# Altium schematic sheet Sheet1.SchDoc
size A4
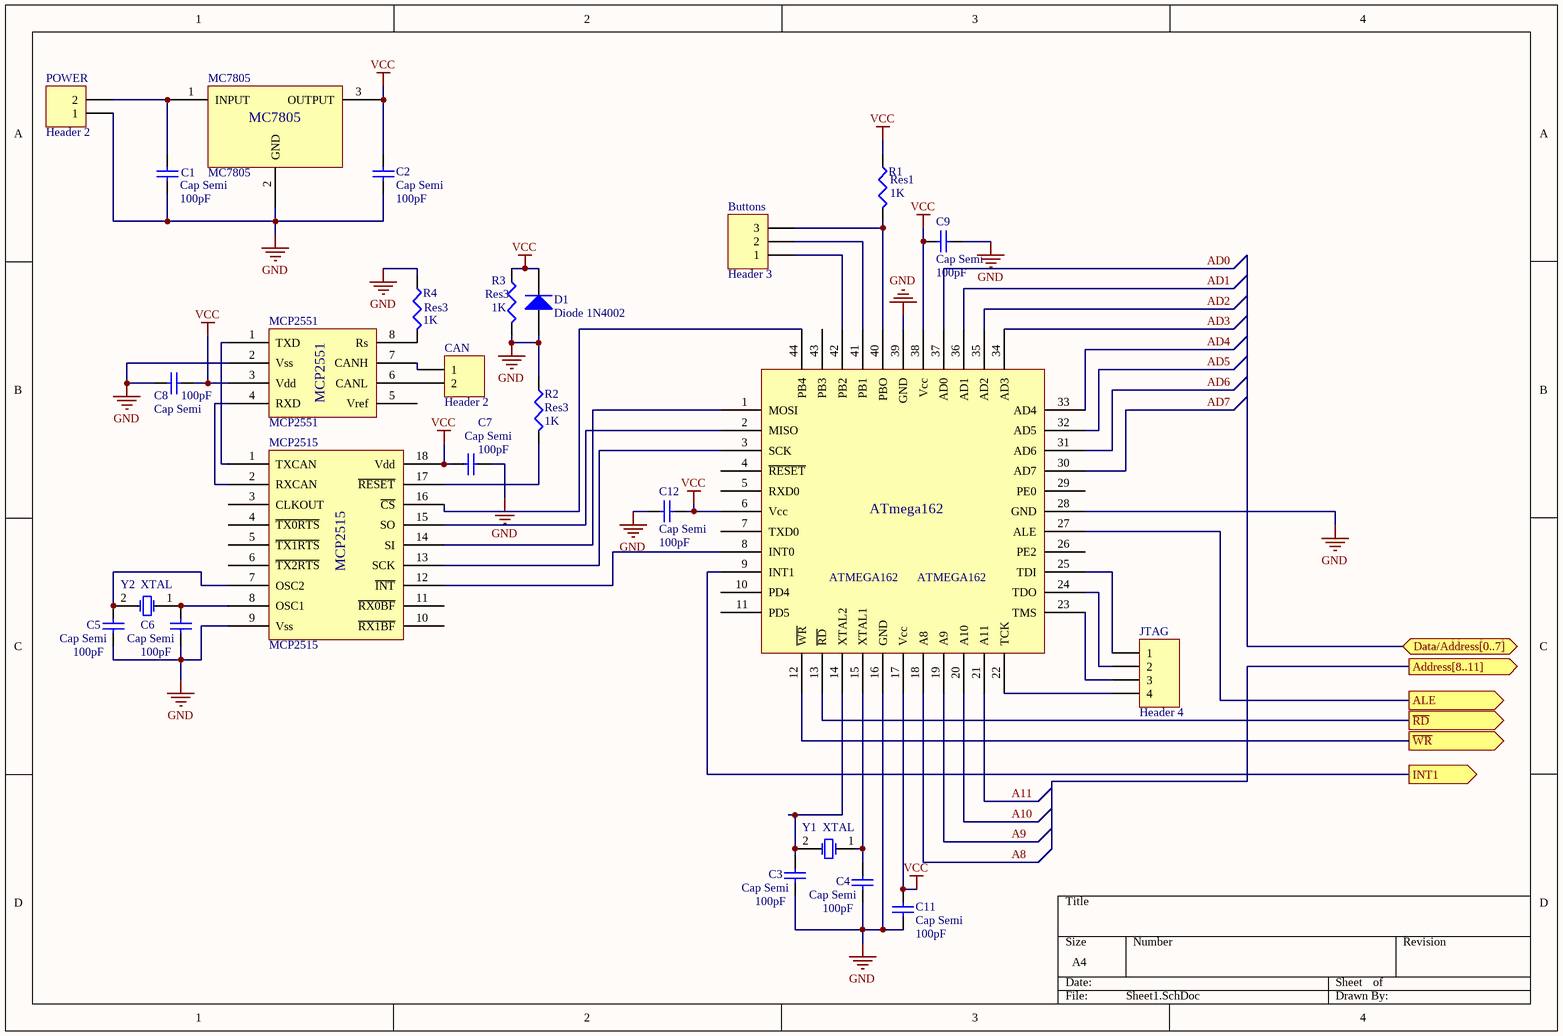
[diagram p0: Sheet1.SchDoc]

## Parts
ATMEGA162  ATMEGA162  [ATmega162 TQFP 44-pin]
Buttons  Header 3  [HDR1X3]
C1  Cap Semi  value 100pF  [C1210]
C2  Cap Semi  value 100pF  [C1210]
C3  Cap Semi  value 100pF  [C1210]
C4  Cap Semi  value 100pF  [C1210]
C5  Cap Semi  value 100pF  [C1210]
C6  Cap Semi  value 100pF  [C1210]
C7  Cap Semi  value 100pF  [C1210]
C8  Cap Semi  value 100pF  [C1210]
C9  Cap Semi  value 100pF  [C1210]
C11  Cap Semi  value 100pF  [C1210]
C12  Cap Semi  value 100pF  [C1210]
CAN  Header 2  [HDR1X2]
D1  Diode 1N4002  [DO-41]
JTAG  Header 4  [HDR1X4]
MC7805  MC7805  [MC7805 DPAK 3-PIN]
MCP2515  MCP2515  [MCP2515 SOIC 18-PIN]
MCP2551  MCP2551  [MACP2551 SOIC 8-PIN]
POWER  Header 2  [HDR1X2]
R1  Res1  value 1K  [14-1210]
R2  Res3  value 1K  [J1-0603]
R3  Res3  value 1K  [J1-0603]
R4  Res3  value 1K  [J1-0603]
Y1  XTAL  [R38]
Y2  XTAL  [R38]

## Ports
Address[8..11] (out), ALE (out), Data/Address[0..7] (bidir), INT1 (out), ~{RD} (out), ~{WR} (out)

## Nets
GND: ATMEGA162.16(GND) ATMEGA162.28(GND) ATMEGA162.39(GND) C1.1 C2.1 C3.2 C4.1 C5.2 C6.2 C7.1 C8.2 C9.2 C11.2 C12.2 D1.1(A) MC7805.2(GND) MCP2515.9(Vss) MCP2551.2(Vss) POWER.1 R2.1 R3.2 R4.1
VCC: ATMEGA162.6(Vcc) ATMEGA162.17(Vcc) ATMEGA162.38(Vcc) C2.2 C7.2 C8.1 C9.1 C11.1 C12.1 D1.2(K) MC7805.3(OUTPUT) MCP2515.18(Vdd) MCP2551.3(Vdd) R1.1 R3.1
A8: ATMEGA162.18(A8)
A9: ATMEGA162.19(A9)
A10: ATMEGA162.20(A10)
A11: ATMEGA162.21(A11)
AD0: ATMEGA162.37(AD0)
AD1: ATMEGA162.36(AD1)
AD2: ATMEGA162.35(AD2)
AD3: ATMEGA162.34(AD3)
AD4: ATMEGA162.33(AD4)
AD5: ATMEGA162.32(AD5)
AD6: ATMEGA162.31(AD6)
AD7: ATMEGA162.30(AD7)
ALE: ATMEGA162.27(ALE) ; port ALE
INT1: ATMEGA162.9(INT1) ; port INT1
~{RD}: ATMEGA162.13(~{RD}) ; port ~{RD}
~{WR}: ATMEGA162.12(~{WR}) ; port ~{WR}
NetATMEGA162_1: ATMEGA162.1(MOSI) MCP2515.14(SI)
NetATMEGA162_2: ATMEGA162.2(MISO) MCP2515.15(SO)
NetATMEGA162_3: ATMEGA162.3(SCK) MCP2515.13(SCK)
NetATMEGA162_8: ATMEGA162.8(INT0) MCP2515.12(~{INT})
NetATMEGA162_14: ATMEGA162.14(XTAL2) C3.1 Y1.2(OSC2)
NetATMEGA162_15: ATMEGA162.15(XTAL1) C4.2 Y1.1(OSC1)
NetATMEGA162_22: ATMEGA162.22(TCK) JTAG.4
NetATMEGA162_23: ATMEGA162.23(TMS) JTAG.3
NetATMEGA162_24: ATMEGA162.24(TDO) JTAG.2
NetATMEGA162_25: ATMEGA162.25(TDI) JTAG.1
NetATMEGA162_40: ATMEGA162.40(PBO) Buttons.3 R1.2
NetATMEGA162_41: ATMEGA162.41(PB1) Buttons.2
NetATMEGA162_42: ATMEGA162.42(PB2) Buttons.1
NetATMEGA162_44: ATMEGA162.44(PB4) MCP2515.16(~{CS})
NetC1_2: C1.2 MC7805.1(INPUT) POWER.2
NetC5_1: C5.1 MCP2515.7(OSC2) Y2.2(OSC2)
NetC6_1: C6.1 MCP2515.8(OSC1) Y2.1(OSC1)
NetCAN_1: CAN.1 MCP2551.7(CANH)
NetCAN_2: CAN.2 MCP2551.6(CANL)
NetMCP2515_1: MCP2515.1(TXCAN) MCP2551.1(TXD)
NetMCP2515_2: MCP2515.2(RXCAN) MCP2551.4(RXD)
NetMCP2515_17: MCP2515.17(~{RESET}) R2.2
NetMCP2551_8: MCP2551.8(Rs) R4.2

Not connected (* = marked no-connect by the designer): ATMEGA162 4(~{RESET}) 5(RXD0) 7(TXD0) 10(PD4) 11(PD5) 26(PE2) 29(PE0) 43(PB3); MCP2515 3(CLKOUT) 4(~{TX0RTS}) 5(~{TX1RTS}) 6(~{TX2RTS}) 10(~{RX1BF}) 11(~{RX0BF}); MCP2551 5(Vref)

## Notes on the sheet
- (in symbol ATMEGA162) ATmega162

## Library data of the parts
ATMEGA162 = ATMEGA162: Atmega162 MicroControllerUnit
Buttons = Header 3: Header, 3-Pin; LatestRevisionDate: 17-Jul-2002; LatestRevisionNote: Re-released for DXP Platform.; Publisher: Altium Limited
C1-C9 C11 C12 = Cap Semi: Capacitor (Semiconductor SIM Model); Published: 8-Jun-2000; LatestRevisionDate: 29-May-2009; LatestRevisionNote: IPC-7351 Footprint Added.; PackageReference: C1206; Publisher: Altium Limited; PackageDescription: Chip Capacitor
CAN POWER = Header 2: Header, 2-Pin; LatestRevisionDate: 17-Jul-2002; LatestRevisionNote: Re-released for DXP Platform.; Publisher: Altium Limited
D1 = Diode 1N4002: 1 Amp General Purpose Rectifier; Published: 8-Jun-2000; LatestRevisionDate: 17-Jul-2002; LatestRevisionNote: Re-released for DXP Platform.; DatasheetVersion: 1998; PackageVersion: Aug-1999; PackageReference: DO-41; Publisher: Altium Limited; PackageDescription: Diode, Axial; Body 5.2 x 2.7 mm (LxDia. max), Lead Dia. 0.86 mm (max); Code_JEDEC: DO-204-AL; ComponentLink1Description: Manufacturer Link; ComponentLink1URL: http://www.fairchildsemi.com/; ComponentLink2Description: Datasheet; ComponentLink2URL: http://www.fairchildsemi.com/ds/1N%2F1N4001.pdf
JTAG = Header 4: Header, 4-Pin; LatestRevisionDate: 17-Jul-2002; LatestRevisionNote: Re-released for DXP Platform.; Publisher: Altium Limited
MC7805 = MC7805: MC7805 Voltage Regulator
MCP2515 = MCP2515: CAN controller
MCP2551 = MCP2551: CAN Transceiver
R1-R4 = Res3: Resistor; Published: 8-Jun-2000; LatestRevisionDate: 29-May-2009; LatestRevisionNote: IPC-7351 Footprint Added.; PackageReference: J1-0603; Publisher: Altium Limited; PackageDescription: Chip Resistor
Y1 Y2 = XTAL: Crystal Oscillator; Published: 8-Jun-2000; LatestRevisionDate: 17-Jul-2002; LatestRevisionNote: Re-released for DXP Platform.; PackageReference: R38; Publisher: Altium Limited; PackageDescription: Crystal, Thru-Hole; 2 Leads; Body 3.1 x 8.2 mm (Dia.xH)